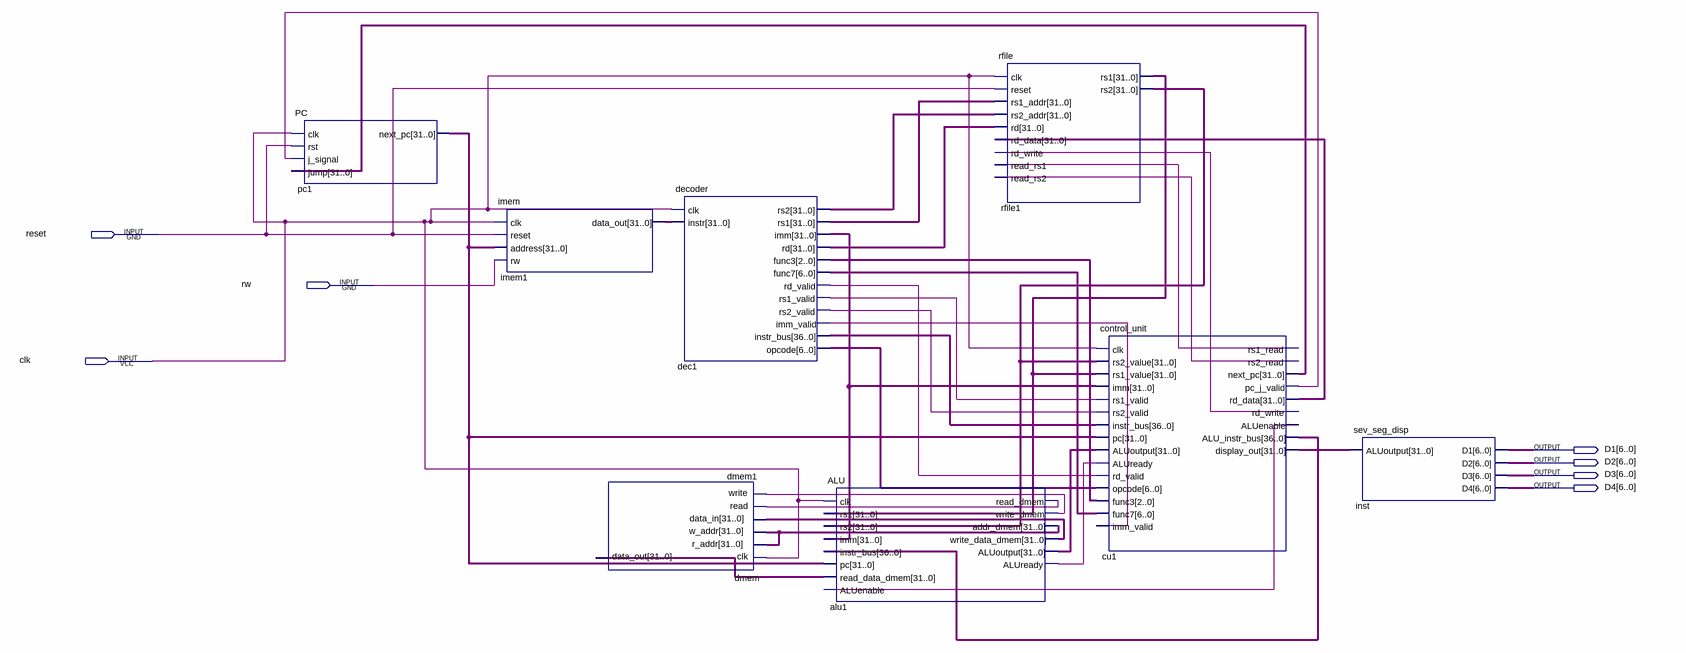
[diagram p0: schematic sheet]
// Quartus schematic RISC_V.bdf as structural Verilog: 8 symbols, 7 pins
module RISC_V (
  input  reset,
  input  rw,
  input  clk,
  output [6:0] D1,
  output [6:0] D2,
  output [6:0] D3,
  output [6:0] D4
);

  wire alu1_aluready, alu1_read_dmem, alu1_write_dmem, cu1_aluenable, cu1_pc_j_valid, cu1_rd_write,
       cu1_rs1_read, cu1_rs2_read, dec1_imm_valid, dec1_rd_valid, dec1_rs1_valid, dec1_rs2_valid;
  wire [2:0] dec1_func3;
  wire [6:0] dec1_func7, dec1_opcode;
  wire [31:0] alu1_addr_dmem, alu1_aluoutput, alu1_write_data_dmem, cu1_display_out, cu1_next_pc,
       cu1_rd_data, dec1_imm, dec1_rd, dec1_rs1, dec1_rs2, dmem1_data_out, imem1_data_out, pc1_next_pc,
       rfile1_rs1, rfile1_rs2;
  wire [36:0] cu1_alu_instr_bus, dec1_instr_bus;

  PC pc1 (.clk(clk), .rst(reset), .j_signal(cu1_pc_j_valid), .jump(cu1_next_pc), .next_pc(pc1_next_pc));
  imem imem1 (.clk(clk), .reset(reset), .address(pc1_next_pc), .rw(rw), .data_out(imem1_data_out));
  dmem dmem1 (
    .clk(clk), .r_addr(alu1_addr_dmem), .w_addr(alu1_addr_dmem), .data_in(alu1_write_data_dmem),
    .read(alu1_read_dmem), .write(alu1_write_dmem), .data_out(dmem1_data_out));
  decoder dec1 (
    .clk(clk), .instr(imem1_data_out), .rs2(dec1_rs2), .rs1(dec1_rs1), .imm(dec1_imm), .rd(dec1_rd),
    .func3(dec1_func3), .func7(dec1_func7), .rd_valid(dec1_rd_valid), .rs1_valid(dec1_rs1_valid),
    .rs2_valid(dec1_rs2_valid), .imm_valid(dec1_imm_valid), .instr_bus(dec1_instr_bus), .opcode(dec1_opcode));
  ALU alu1 (
    .clk(clk), .rs1(rfile1_rs1), .rs2(rfile1_rs2), .imm(dec1_imm), .instr_bus(cu1_alu_instr_bus),
    .pc(pc1_next_pc), .read_data_dmem(dmem1_data_out), .ALUenable(cu1_aluenable), .read_dmem(alu1_read_dmem),
    .write_dmem(alu1_write_dmem), .addr_dmem(alu1_addr_dmem), .write_data_dmem(alu1_write_data_dmem),
    .ALUoutput(alu1_aluoutput), .ALUready(alu1_aluready));
  rfile rfile1 (
    .clk(clk), .reset(reset), .rs1_addr(dec1_rs1), .rs2_addr(dec1_rs2), .rd(dec1_rd), .rd_data(cu1_rd_data),
    .rd_write(cu1_rd_write), .read_rs1(cu1_rs1_read), .read_rs2(cu1_rs2_read), .rs1(rfile1_rs1),
    .rs2(rfile1_rs2));
  control_unit cu1 (
    .clk(clk), .rs2_value(rfile1_rs2), .rs1_value(rfile1_rs1), .imm(dec1_imm), .rs1_valid(dec1_rs1_valid),
    .rs2_valid(dec1_rs2_valid), .instr_bus(dec1_instr_bus), .pc(pc1_next_pc), .ALUoutput(alu1_aluoutput),
    .ALUready(alu1_aluready), .rd_valid(dec1_rd_valid), .opcode(dec1_opcode), .func3(dec1_func3),
    .func7(dec1_func7), .imm_valid(dec1_imm_valid), .rs1_read(cu1_rs1_read), .rs2_read(cu1_rs2_read),
    .next_pc(cu1_next_pc), .pc_j_valid(cu1_pc_j_valid), .rd_data(cu1_rd_data), .rd_write(cu1_rd_write),
    .ALUenable(cu1_aluenable), .ALU_instr_bus(cu1_alu_instr_bus), .display_out(cu1_display_out));
  sev_seg_disp inst (.ALUoutput(cu1_display_out), .D1(D1), .D2(D2), .D3(D3), .D4(D4));
endmodule
